# Altium schematic sheet TopLevelSCH.SchDoc
size 420 x 297 mm
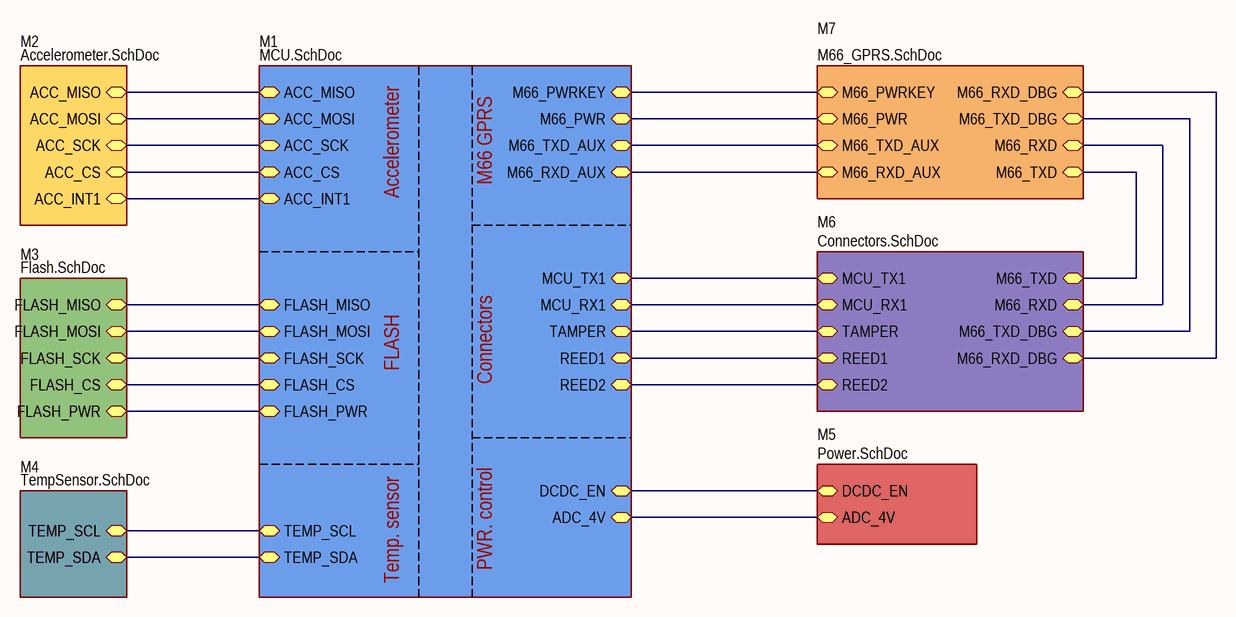
[diagram p0: TopLevelSCH.SchDoc]

## Sub-sheets
M1 = MCU.SchDoc: DCDC_EN (bidir), REED2 (bidir), REED1 (bidir), MCU_TX1 (bidir), TAMPER (bidir), MCU_RX1 (bidir), TEMP_SDA (bidir), TEMP_SCL (bidir), ACC_INT1 (bidir), ACC_MOSI (bidir), ACC_MISO (bidir), ACC_SCK (bidir), ACC_CS (bidir), FLASH_PWR (bidir), FLASH_CS (bidir), FLASH_SCK (bidir), FLASH_MOSI (bidir), FLASH_MISO (bidir), ADC_4V (bidir), M66_PWRKEY (bidir), M66_PWR (bidir), M66_TXD_AUX (bidir), M66_RXD_AUX (bidir)
M2 = Accelerometer.SchDoc: ACC_INT1 (bidir), ACC_MOSI (bidir), ACC_MISO (bidir), ACC_SCK (bidir), ACC_CS (bidir)
M3 = Flash.SchDoc: FLASH_PWR (bidir), FLASH_CS (bidir), FLASH_SCK (bidir), FLASH_MOSI (bidir), FLASH_MISO (bidir)
M4 = TempSensor.SchDoc: TEMP_SDA (bidir), TEMP_SCL (bidir)
M5 = Power.SchDoc: ADC_4V (bidir), DCDC_EN (bidir)
M6 = Connectors.SchDoc: MCU_TX1 (bidir), MCU_RX1 (bidir), TAMPER (bidir), REED2 (bidir), REED1 (bidir), M66_TXD_DBG (bidir), M66_RXD_DBG (bidir), M66_RXD (bidir), M66_TXD (bidir)
M7 = M66_GPRS.SchDoc: M66_PWRKEY (bidir), M66_PWR (bidir), M66_TXD_DBG (bidir), M66_RXD_DBG (bidir), M66_RXD_AUX (bidir), M66_TXD_AUX (bidir), M66_RXD (bidir), M66_TXD (bidir)

## Nets
(unnamed): sheet M1/DCDC_EN, sheet M5/DCDC_EN
(unnamed): sheet M1/REED2, sheet M6/REED2
(unnamed): sheet M1/REED1, sheet M6/REED1
(unnamed): sheet M1/MCU_TX1, sheet M6/MCU_TX1
(unnamed): sheet M1/TAMPER, sheet M6/TAMPER
(unnamed): sheet M1/MCU_RX1, sheet M6/MCU_RX1
(unnamed): sheet M1/TEMP_SDA, sheet M4/TEMP_SDA
(unnamed): sheet M1/TEMP_SCL, sheet M4/TEMP_SCL
(unnamed): sheet M1/ACC_INT1, sheet M2/ACC_INT1
(unnamed): sheet M1/ACC_MOSI, sheet M2/ACC_MOSI
(unnamed): sheet M1/ACC_MISO, sheet M2/ACC_MISO
(unnamed): sheet M1/ACC_SCK, sheet M2/ACC_SCK
(unnamed): sheet M1/ACC_CS, sheet M2/ACC_CS
(unnamed): sheet M1/FLASH_PWR, sheet M3/FLASH_PWR
(unnamed): sheet M1/FLASH_CS, sheet M3/FLASH_CS
(unnamed): sheet M1/FLASH_SCK, sheet M3/FLASH_SCK
(unnamed): sheet M1/FLASH_MOSI, sheet M3/FLASH_MOSI
(unnamed): sheet M1/FLASH_MISO, sheet M3/FLASH_MISO
(unnamed): sheet M1/ADC_4V, sheet M5/ADC_4V
(unnamed): sheet M1/M66_PWRKEY, sheet M7/M66_PWRKEY
(unnamed): sheet M1/M66_PWR, sheet M7/M66_PWR
(unnamed): sheet M1/M66_TXD_AUX, sheet M7/M66_TXD_AUX
(unnamed): sheet M1/M66_RXD_AUX, sheet M7/M66_RXD_AUX
(unnamed): sheet M6/M66_TXD_DBG, sheet M7/M66_TXD_DBG
(unnamed): sheet M6/M66_RXD_DBG, sheet M7/M66_RXD_DBG
(unnamed): sheet M6/M66_RXD, sheet M7/M66_RXD
(unnamed): sheet M6/M66_TXD, sheet M7/M66_TXD

## Notes on the sheet
- M66 GPRS
- Accelerometer
- FLASH
- Connectors
- Temp. sensor
- PWR. control
- Author
- Manufacturer
- Date
- Page
- Total pages
- Size page
- A3
- Materials